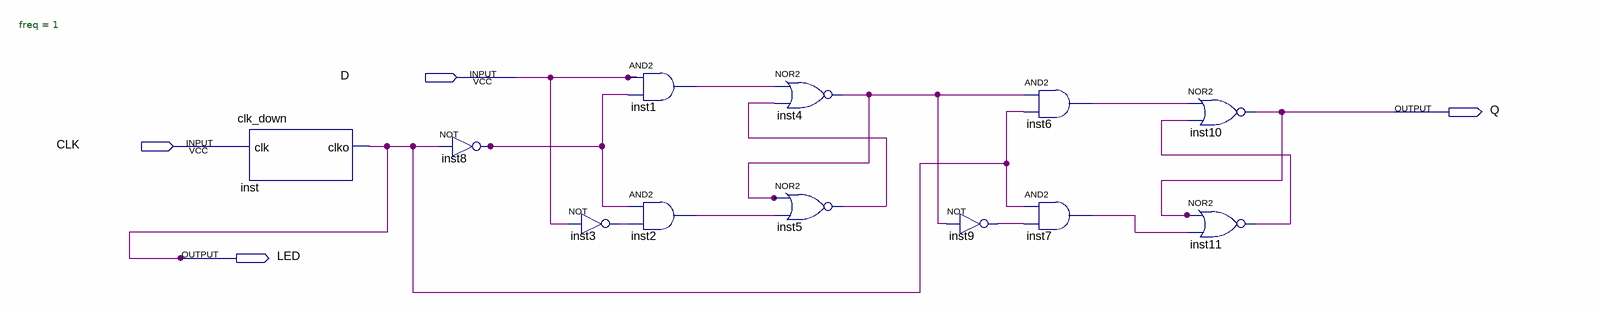
[diagram p0: schematic sheet]
// Quartus schematic LAB043.bdf as structural Verilog: 12 symbols, 4 pins
module LAB043 (
  input  D,
  input  CLK,
  output Q,
  output LED
);

  wire inst1_out, inst2_out, inst3_out, inst4_out, inst5_out, inst6_out, inst7_out, inst8_out, inst9_out,
       inst11_out;

  clk_down #(.freq(1)) inst (.clk(CLK), .clko(LED));
  not inst8 (inst8_out, LED);
  and inst1 (inst1_out, D, inst8_out);
  and inst2 (inst2_out, inst8_out, inst3_out);
  not inst3 (inst3_out, D);
  nor inst4 (inst4_out, inst1_out, inst5_out);
  nor inst5 (inst5_out, inst4_out, inst2_out);
  not inst9 (inst9_out, inst4_out);
  and inst6 (inst6_out, inst4_out, LED);
  and inst7 (inst7_out, LED, inst9_out);
  nor inst10 (Q, inst6_out, inst11_out);
  nor inst11 (inst11_out, Q, inst7_out);
endmodule
